# Altium schematic sheet Sheet1.SchDoc
size E; SheetNumber: 1; SheetTotal: 1
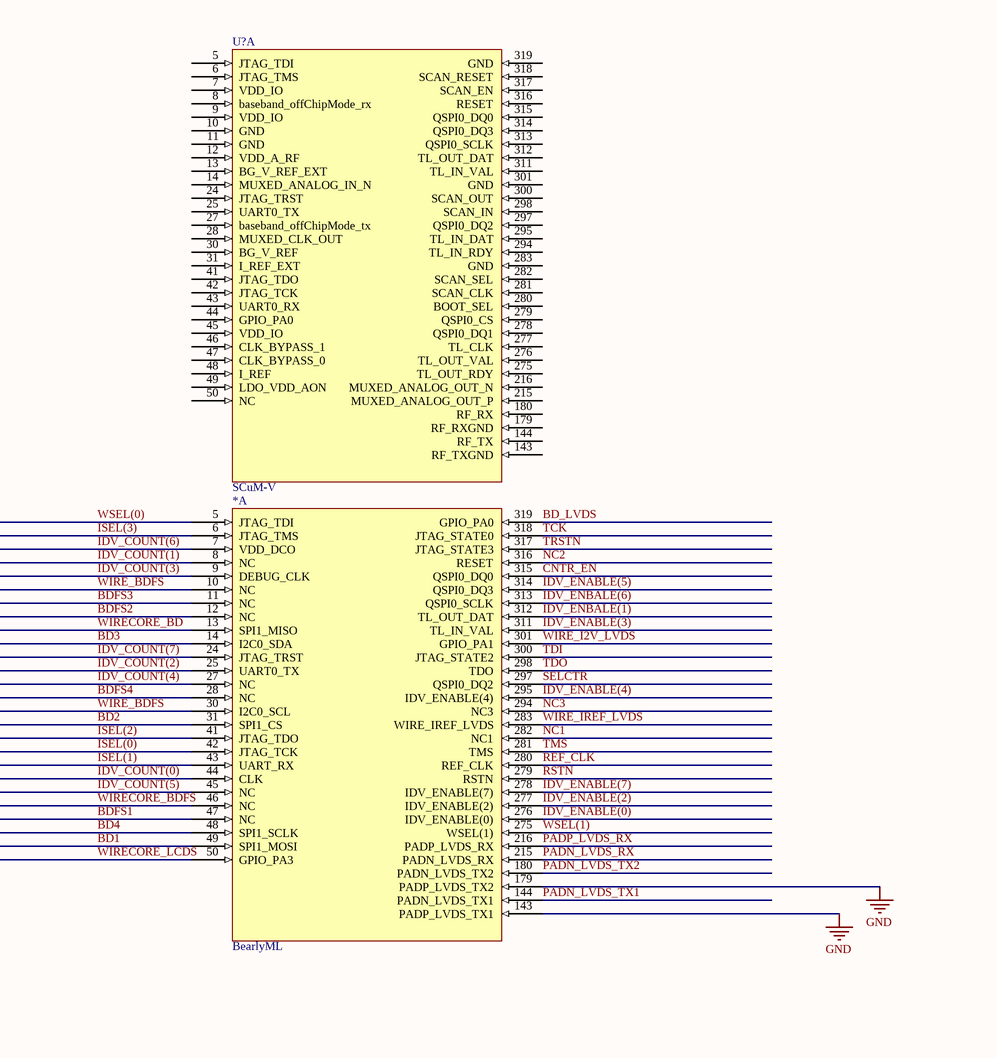
[diagram p0: Sheet1.SchDoc, top left]
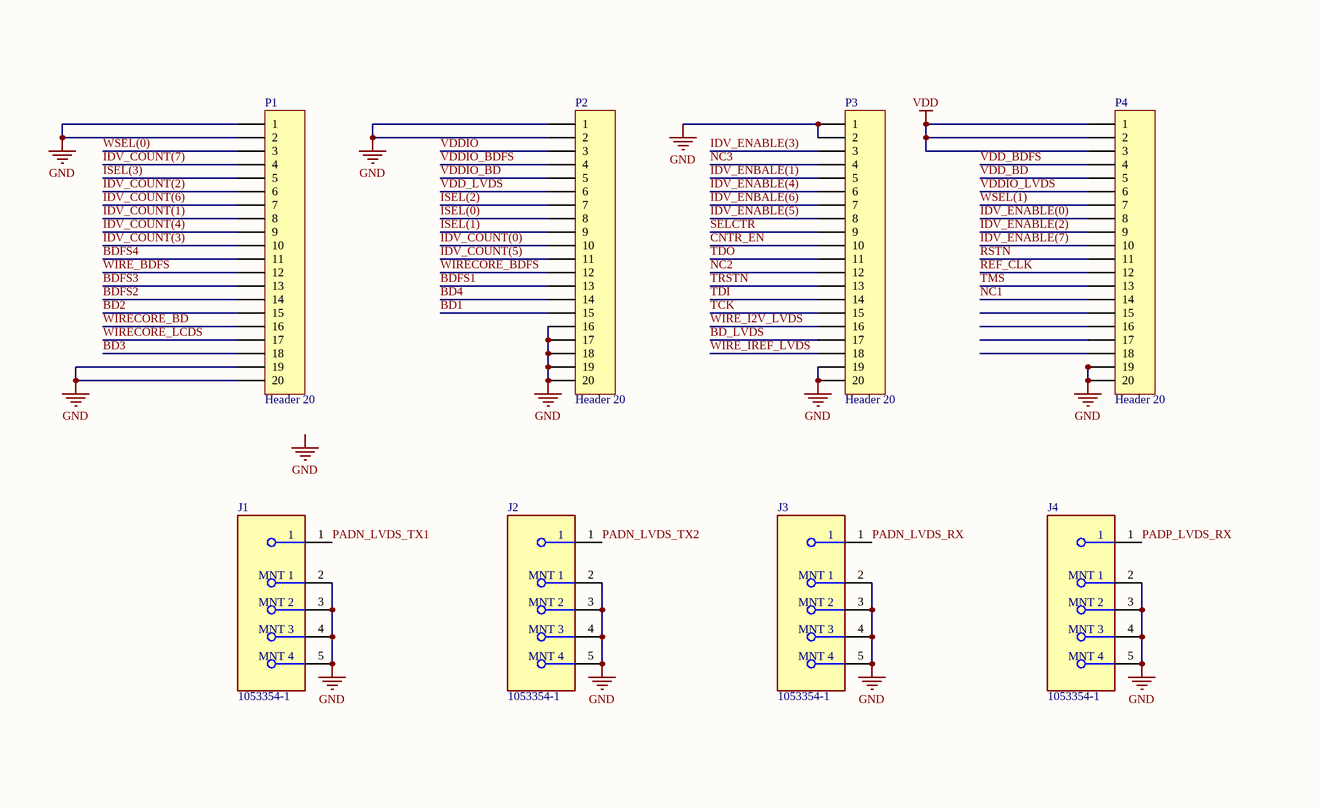
[diagram p1: Sheet1.SchDoc, bottom left]
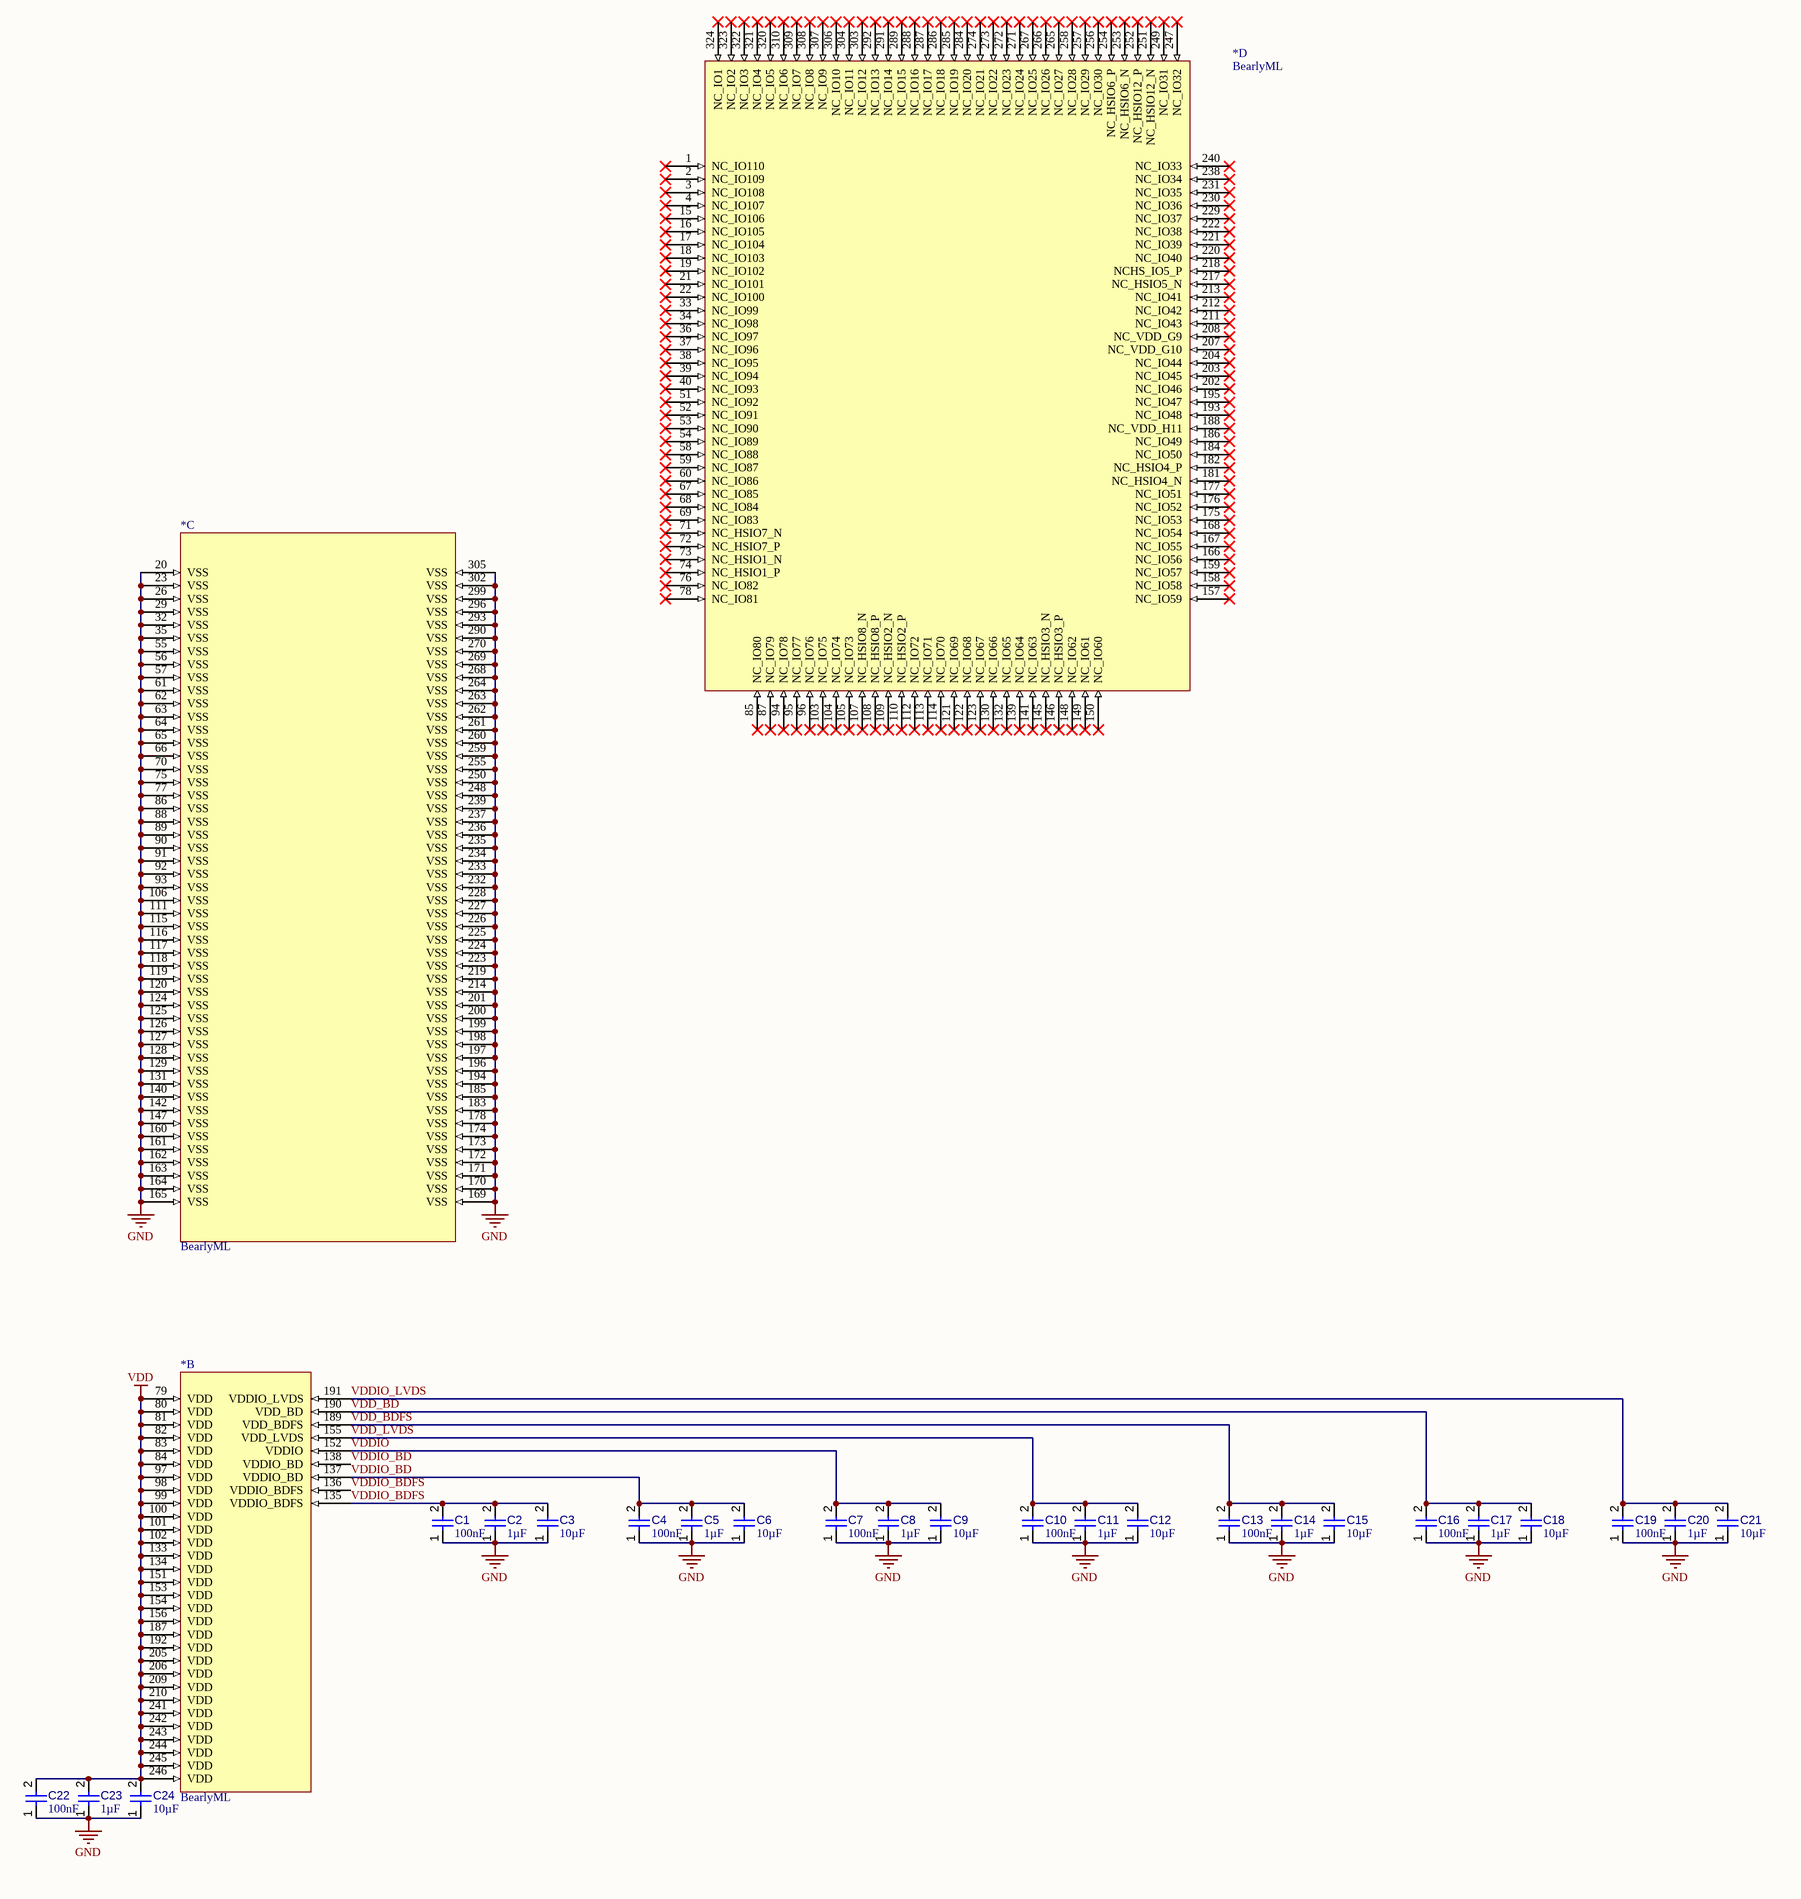
[diagram p2: Sheet1.SchDoc, bottom right]

## Parts
(Parts that share a designator on the sheet are numbered #1, #2 ... from top to bottom, then left to right.)
*#1  BearlyML  [BGA324x18]  (part A of 4)
*#2  BearlyML  [BGA324x18]  (part D of 4)
*#3  BearlyML  [BGA324x18]  (part C of 4)
*#4  BearlyML  [BGA324x18]  (part B of 4)
C1  value 100nF  [CAPC0402(1005)60_L]  (hidden comment: Capacitor 100nF +/-20% 50V 0402)
C2  value 1µF  [CAPC0402(1005)60_L]  (hidden comment: Capacitor 1µF +/-20% 10V 0402)
C3  value 10µF  [CAPC0402(1005)60_L]  (hidden comment: Capacitor 10µF +/-40% 6.3V 0402)
C4  value 100nF  [CAPC0402(1005)60_L]  (hidden comment: Capacitor 100nF +/-20% 50V 0402)
C5  value 1µF  [CAPC0402(1005)60_L]  (hidden comment: Capacitor 1µF +/-20% 10V 0402)
C6  value 10µF  [CAPC0402(1005)60_L]  (hidden comment: Capacitor 10µF +/-40% 6.3V 0402)
C7  value 100nF  [CAPC0402(1005)60_L]  (hidden comment: Capacitor 100nF +/-20% 50V 0402)
C8  value 1µF  [CAPC0402(1005)60_L]  (hidden comment: Capacitor 1µF +/-20% 10V 0402)
C9  value 10µF  [CAPC0402(1005)60_L]  (hidden comment: Capacitor 10µF +/-40% 6.3V 0402)
C10  value 100nF  [CAPC0402(1005)60_L]  (hidden comment: Capacitor 100nF +/-20% 50V 0402)
C11  value 1µF  [CAPC0402(1005)60_L]  (hidden comment: Capacitor 1µF +/-20% 10V 0402)
C12  value 10µF  [CAPC0402(1005)60_L]  (hidden comment: Capacitor 10µF +/-40% 6.3V 0402)
C13  value 100nF  [CAPC0402(1005)60_L]  (hidden comment: Capacitor 100nF +/-20% 50V 0402)
C14  value 1µF  [CAPC0402(1005)60_L]  (hidden comment: Capacitor 1µF +/-20% 10V 0402)
C15  value 10µF  [CAPC0402(1005)60_L]  (hidden comment: Capacitor 10µF +/-40% 6.3V 0402)
C16  value 100nF  [CAPC0402(1005)60_L]  (hidden comment: Capacitor 100nF +/-20% 50V 0402)
C17  value 1µF  [CAPC0402(1005)60_L]  (hidden comment: Capacitor 1µF +/-20% 10V 0402)
C18  value 10µF  [CAPC0402(1005)60_L]  (hidden comment: Capacitor 10µF +/-40% 6.3V 0402)
C19  value 100nF  [CAPC0402(1005)60_L]  (hidden comment: Capacitor 100nF +/-20% 50V 0402)
C20  value 1µF  [CAPC0402(1005)60_L]  (hidden comment: Capacitor 1µF +/-20% 10V 0402)
C21  value 10µF  [CAPC0402(1005)60_L]  (hidden comment: Capacitor 10µF +/-40% 6.3V 0402)
C22  value 100nF  [CAPC0402(1005)60_L]  (hidden comment: Capacitor 100nF +/-20% 50V 0402)
C23  value 1µF  [CAPC0402(1005)60_L]  (hidden comment: Capacitor 1µF +/-20% 10V 0402)
C24  value 10µF  [CAPC0402(1005)60_L]  (hidden comment: Capacitor 10µF +/-40% 6.3V 0402)
J1  1053354-1  [FP-1053354-1-MFG]
J2  1053354-1  [FP-1053354-1-MFG]
J3  1053354-1  [FP-1053354-1-MFG]
J4  1053354-1  [FP-1053354-1-MFG]
P1  Header 20  [HDR1X20]
P2  Header 20  [HDR1X20]
P3  Header 20  [HDR1X20]
P4  Header 20  [HDR1X20]
U?  SCuM-V  [BGA324x18]  (part A of 4)

## Nets
GND: *#1.143(PADP_LVDS_TX1) *#1.179(PADP_LVDS_TX2) *#3.20(VSS) *#3.23(VSS) *#3.26(VSS) *#3.29(VSS) *#3.32(VSS) *#3.35(VSS) *#3.55(VSS) *#3.56(VSS) *#3.57(VSS) *#3.61(VSS) *#3.62(VSS) *#3.63(VSS) *#3.64(VSS) *#3.65(VSS) *#3.66(VSS) *#3.70(VSS) *#3.75(VSS) *#3.77(VSS) *#3.86(VSS) *#3.88(VSS) *#3.89(VSS) *#3.90(VSS) *#3.91(VSS) *#3.92(VSS) *#3.93(VSS) *#3.106(VSS) *#3.111(VSS) *#3.115(VSS) *#3.116(VSS) *#3.117(VSS) *#3.118(VSS) *#3.119(VSS) *#3.120(VSS) *#3.124(VSS) *#3.125(VSS) *#3.126(VSS) *#3.127(VSS) *#3.128(VSS) *#3.129(VSS) *#3.131(VSS) *#3.140(VSS) *#3.142(VSS) *#3.147(VSS) *#3.160(VSS) *#3.161(VSS) *#3.162(VSS) *#3.163(VSS) *#3.164(VSS) *#3.165(VSS) *#3.169(VSS) *#3.170(VSS) *#3.171(VSS) *#3.172(VSS) *#3.173(VSS) *#3.174(VSS) *#3.178(VSS) *#3.183(VSS) *#3.185(VSS) *#3.194(VSS) *#3.196(VSS) *#3.197(VSS) *#3.198(VSS) *#3.199(VSS) *#3.200(VSS) *#3.201(VSS) *#3.214(VSS) *#3.219(VSS) *#3.223(VSS) *#3.224(VSS) *#3.225(VSS) *#3.226(VSS) *#3.227(VSS) *#3.228(VSS) *#3.232(VSS) *#3.233(VSS) *#3.234(VSS) *#3.235(VSS) *#3.236(VSS) *#3.237(VSS) *#3.239(VSS) *#3.248(VSS) *#3.250(VSS) *#3.255(VSS) *#3.259(VSS) *#3.260(VSS) *#3.261(VSS) *#3.262(VSS) *#3.263(VSS) *#3.264(VSS) *#3.268(VSS) *#3.269(VSS) *#3.270(VSS) *#3.290(VSS) *#3.293(VSS) *#3.296(VSS) *#3.299(VSS) *#3.302(VSS) *#3.305(VSS) C1.1 C2.1 C3.1 C4.1 C5.1 C6.1 C7.1 C8.1 C9.1 C10.1 C11.1 C12.1 C13.1 C14.1 C15.1 C16.1 C17.1 C18.1 C19.1 C20.1 C21.1 C22.1 C23.1 C24.1 J1.2(MNT_1) J1.3(MNT_2) J1.4(MNT_3) J1.5(MNT_4) J2.2(MNT_1) J2.3(MNT_2) J2.4(MNT_3) J2.5(MNT_4) J3.2(MNT_1) J3.3(MNT_2) J3.4(MNT_3) J3.5(MNT_4) J4.2(MNT_1) J4.3(MNT_2) J4.4(MNT_3) J4.5(MNT_4) P1.1 P1.2 P1.19 P1.20 P2.1 P2.2 P2.16 P2.17 P2.18 P2.19 P2.20 P3.1 P3.2 P3.19 P3.20 P4.19 P4.20
VDD: *#4.79(VDD) *#4.80(VDD) *#4.81(VDD) *#4.82(VDD) *#4.83(VDD) *#4.84(VDD) *#4.97(VDD) *#4.98(VDD) *#4.99(VDD) *#4.100(VDD) *#4.101(VDD) *#4.102(VDD) *#4.133(VDD) *#4.134(VDD) *#4.151(VDD) *#4.153(VDD) *#4.154(VDD) *#4.156(VDD) *#4.187(VDD) *#4.192(VDD) *#4.205(VDD) *#4.206(VDD) *#4.209(VDD) *#4.210(VDD) *#4.241(VDD) *#4.242(VDD) *#4.243(VDD) *#4.244(VDD) *#4.245(VDD) *#4.246(VDD) C22.2 C23.2 C24.2 P4.1 P4.2 P4.3
BD1: *#1.49(SPI1_MOSI) P2.15
BD2: *#1.31(SPI1_CS) P1.15
BD3: *#1.14(I2C0_SDA) P1.18
BD4: *#1.48(SPI1_SCLK) P2.14
BD_LVDS: *#1.319(GPIO_PA0) P3.17
BDFS1: *#1.47(NC) P2.13
BDFS2: *#1.12(NC) P1.14
BDFS3: *#1.11(NC) P1.13
BDFS4: *#1.28(NC) P1.11
CNTR_EN: *#1.315(QSPI0_DQ0) P3.10
IDV_COUNT(0): *#1.44(CLK) P2.10
IDV_COUNT(1): *#1.8(NC) P1.8
IDV_COUNT(2): *#1.25(UART0_TX) P1.6
IDV_COUNT(3): *#1.9(DEBUG_CLK) P1.10
IDV_COUNT(4): *#1.27(NC) P1.9
IDV_COUNT(5): *#1.45(NC) P2.11
IDV_COUNT(6): *#1.7(VDD_DCO) P1.7
IDV_COUNT(7): *#1.24(JTAG_TRST) P1.4
IDV_ENABLE(0): *#1.276(IDV_ENABLE(0)) P4.8
IDV_ENABLE(2): *#1.277(IDV_ENABLE(2)) P4.9
IDV_ENABLE(3): *#1.311(TL_IN_VAL) P3.3
IDV_ENABLE(4): *#1.295(IDV_ENABLE(4)) P3.6
IDV_ENABLE(5): *#1.314(QSPI0_DQ3) P3.8
IDV_ENABLE(7): *#1.278(IDV_ENABLE(7)) P4.10
IDV_ENBALE(1): *#1.312(TL_OUT_DAT) P3.5
IDV_ENBALE(6): *#1.313(QSPI0_SCLK) P3.7
ISEL(0): *#1.42(JTAG_TCK) P2.8
ISEL(1): *#1.43(UART_RX) P2.9
ISEL(2): *#1.41(JTAG_TDO) P2.7
ISEL(3): *#1.6(JTAG_TMS) P1.5
NC1: *#1.282(NC1) P4.14
NC2: *#1.316(RESET) P3.12
NC3: *#1.294(NC3) P3.4
PADN_LVDS_RX: *#1.215(PADN_LVDS_RX) J3.1
PADN_LVDS_TX1: *#1.144(PADN_LVDS_TX1) J1.1
PADN_LVDS_TX2: *#1.180(PADN_LVDS_TX2) J2.1
PADP_LVDS_RX: *#1.216(PADP_LVDS_RX) J4.1
REF_CLK: *#1.280(REF_CLK) P4.12
RSTN: *#1.279(RSTN) P4.11
SELCTR: *#1.297(QSPI0_DQ2) P3.9
TCK: *#1.318(JTAG_STATE0) P3.15
TDI: *#1.300(JTAG_STATE2) P3.14
TDO: *#1.298(TDO) P3.11
TMS: *#1.281(TMS) P4.13
TRSTN: *#1.317(JTAG_STATE3) P3.13
VDD_BD: *#4.190(VDD_BD) C16.2 C17.2 C18.2 P4.5
VDD_BDFS: *#4.189(VDD_BDFS) C13.2 C14.2 C15.2 P4.4
VDD_LVDS: *#4.155(VDD_LVDS) C10.2 C11.2 C12.2 P2.6
VDDIO: *#4.152(VDDIO) C7.2 C8.2 C9.2 P2.3
VDDIO_BD: *#4.137(VDDIO_BD) *#4.138(VDDIO_BD) C4.2 C5.2 C6.2 P2.5
VDDIO_BDFS: *#4.135(VDDIO_BDFS) *#4.136(VDDIO_BDFS) C1.2 C2.2 C3.2 P2.4
VDDIO_LVDS: *#4.191(VDDIO_LVDS) C19.2 C20.2 C21.2 P4.6
WIRE_BDFS: *#1.10(NC) *#1.30(I2C0_SCL) P1.12
WIRE_I2V_LVDS: *#1.301(GPIO_PA1) P3.16
WIRE_IREF_LVDS: *#1.283(WIRE_IREF_LVDS) P3.18
WIRECORE_BD: *#1.13(SPI1_MISO) P1.16
WIRECORE_BDFS: *#1.46(NC) P2.12
WIRECORE_LCDS: *#1.50(GPIO_PA3) P1.17
WSEL(0): *#1.5(JTAG_TDI) P1.3
WSEL(1): *#1.275(WSEL(1)) P4.7

Not connected (* = marked no-connect by the designer): *#2 1(NC_IO110)* 2(NC_IO109)* 3(NC_IO108)* 4(NC_IO107)* 15(NC_IO106)* 16(NC_IO105)* 17(NC_IO104)* 18(NC_IO103)* 19(NC_IO102)* 21(NC_IO101)* 22(NC_IO100)* 33(NC_IO99)* 34(NC_IO98)* 36(NC_IO97)* 37(NC_IO96)* 38(NC_IO95)* 39(NC_IO94)* 40(NC_IO93)* 51(NC_IO92)* 52(NC_IO91)* 53(NC_IO90)* 54(NC_IO89)* 58(NC_IO88)* 59(NC_IO87)* 60(NC_IO86)* 67(NC_IO85)* 68(NC_IO84)* 69(NC_IO83)* 71(NC_HSIO7_N)* 72(NC_HSIO7_P)* 73(NC_HSIO1_N)* 74(NC_HSIO1_P)* 76(NC_IO82)* 78(NC_IO81)* 85(NC_IO80)* 87(NC_IO79)* 94(NC_IO78)* 95(NC_IO77)* 96(NC_IO76)* 103(NC_IO75)* 104(NC_IO74)* 105(NC_IO73)* 107(NC_HSIO8_N)* 108(NC_HSIO8_P)* 109(NC_HSIO2_N)* 110(NC_HSIO2_P)* 112(NC_IO72)* 113(NC_IO71)* 114(NC_IO70)* 121(NC_IO69)* 122(NC_IO68)* 123(NC_IO67)* 130(NC_IO66)* 132(NC_IO65)* 139(NC_IO64)* 141(NC_IO63)* 145(NC_HSIO3_N)* 146(NC_HSIO3_P)* 148(NC_IO62)* 149(NC_IO61)* 150(NC_IO60)* 157(NC_IO59)* 158(NC_IO58)* 159(NC_IO57)* 166(NC_IO56)* 167(NC_IO55)* 168(NC_IO54)* 175(NC_IO53)* 176(NC_IO52)* 177(NC_IO51)* 181(NC_HSIO4_N)* 182(NC_HSIO4_P)* 184(NC_IO50)* 186(NC_IO49)* 188(NC_VDD_H11)* 193(NC_IO48)* 195(NC_IO47)* 202(NC_IO46)* 203(NC_IO45)* 204(NC_IO44)* 207(NC_VDD_G10)* 208(NC_VDD_G9)* 211(NC_IO43)* 212(NC_IO42)* 213(NC_IO41)* 217(NC_HSIO5_N)* 218(NCHS_IO5_P)* 220(NC_IO40)* 221(NC_IO39)* 222(NC_IO38)* 229(NC_IO37)* 230(NC_IO36)* 231(NC_IO35)* 238(NC_IO34)* 240(NC_IO33)* 247(NC_IO32)* 249(NC_IO31)* 251(NC_HSIO12_N)* 252(NC_HSIO12_P)* 253(NC_HSIO6_N)* 254(NC_HSIO6_P)* 256(NC_IO30)* 257(NC_IO29)* 258(NC_IO28)* 265(NC_IO27)* 266(NC_IO26)* 267(NC_IO25)* 271(NC_IO24)* 272(NC_IO23)* 273(NC_IO22)* 274(NC_IO21)* 284(NC_IO20)* 285(NC_IO19)* 286(NC_IO18)* 287(NC_IO17)* 288(NC_IO16)* 289(NC_IO15)* 291(NC_IO14)* 292(NC_IO13)* 303(NC_IO12)* 304(NC_IO11)* 306(NC_IO10)* 307(NC_IO9)* 308(NC_IO8)* 309(NC_IO7)* 310(NC_IO6)* 320(NC_IO5)* 321(NC_IO4)* 322(NC_IO3)* 323(NC_IO2)* 324(NC_IO1)*; P4 15 16 17 18; U? 5(JTAG_TDI) 6(JTAG_TMS) 7(VDD_IO) 8(baseband_offChipMode_rx) 9(VDD_IO) 10(GND) 11(GND) 12(VDD_A_RF) 13(BG_V_REF_EXT) 14(MUXED_ANALOG_IN_N) 24(JTAG_TRST) 25(UART0_TX) 27(baseband_offChipMode_tx) 28(MUXED_CLK_OUT) 30(BG_V_REF) 31(I_REF_EXT) 41(JTAG_TDO) 42(JTAG_TCK) 43(UART0_RX) 44(GPIO_PA0) 45(VDD_IO) 46(CLK_BYPASS_1) 47(CLK_BYPASS_0) 48(I_REF) 49(LDO_VDD_AON) 50(NC) 143(RF_TXGND) 144(RF_TX) 179(RF_RXGND) 180(RF_RX) 215(MUXED_ANALOG_OUT_P) 216(MUXED_ANALOG_OUT_N) 275(TL_OUT_RDY) 276(TL_OUT_VAL) 277(TL_CLK) 278(QSPI0_DQ1) 279(QSPI0_CS) 280(BOOT_SEL) 281(SCAN_CLK) 282(SCAN_SEL) 283(GND) 294(TL_IN_RDY) 295(TL_IN_DAT) 297(QSPI0_DQ2) 298(SCAN_IN) 300(SCAN_OUT) 301(GND) 311(TL_IN_VAL) 312(TL_OUT_DAT) 313(QSPI0_SCLK) 314(QSPI0_DQ3) 315(QSPI0_DQ0) 316(RESET) 317(SCAN_EN) 318(SCAN_RESET) 319(GND)

## Notes on the sheet
- Labels drawn without touching a wire or pin: GND

## Library data of the parts
*#1-*#4 = BearlyML-1: BearlyML chip from Sp22 Tapeout class
C1 C4 C7 C10 C13 C16 C19 C22 = CMP-001-00067-3: Chip Capacitor, 100nF +/-20%, 50V, 0402, Thickness 0.6 mm; Tolerance: 10%; Min Operating Temperature: -55°C; Pins: 2; Case/Package: 0402; Max Operating Temperature: 85°C; Voltage Rating: 50V; Mounting Technology: SMT
C2 C5 C8 C11 C14 C17 C20 C23 = CMP-001-00063-3: Chip Capacitor, 1µF +/-20%, 10V, 0402, Thickness 0.6 mm; Tolerance: 10%; Mounting Technology: SMT; Max Operating Temperature: 85°C; Voltage Rating: 10V; Pins: 2; Case/Package: 0402; Min Operating Temperature: -55°C
C3 C6 C9 C12 C15 C18 C21 C24 = CMP-001-00074-3: Chip Capacitor, 10µF +/-40%, 6.3V, 0402, Thickness 0.6 mm; Tolerance: 10%; Case/Package: 0402; Pins: 2; Mounting Technology: SMT; Voltage Rating: 6.3V; Max Operating Temperature: 85°C; Min Operating Temperature: -55°C
J1-J4 = CMP-2000-05830-2: CONN SMA JACK STR 50 OHM PCB; Dielectric Material: PTFE; Impedance: 50R; Frequency: 18GHz; Polarity: Normal; Body Material: Stainless Steel; Max Frequency: 12.4GHz; Center Contact Plating: Gold; PCB Mounting Orientation: Vertical; Mating Cycles: 500; Gender: Female; Number of Ports: 1; Packaging: Bag; Contact Plating: Gold; REACH SVHC: No SVHC; Radiation Hardening: No; Mount: Through Hole; Fastening Type: Threaded; Package Quantity: 125; Connector Type: SMA; Operating Frequency: N/A; Height: 9.5mm; Plating: Gold; RoHS Compliant: Yes; Insulation Material: Polytetrafluoroethylene; Length: 9.53mm; Contact Material: Copper; Orientation: Straight; Case/Package: SMA; Depth: 6.3mm; Series: SMA; Termination: Solder; Housing Color: Gold; Body Plating: Gold
P1-P4 = Header 20: Header, 20-Pin; LatestRevisionDate: 17-Jul-2002; LatestRevisionNote: Re-released for DXP Platform.; Publisher: Altium Limited
U? = SCuM-V-2: SCuM-V chip from Sp22 Tapeout class